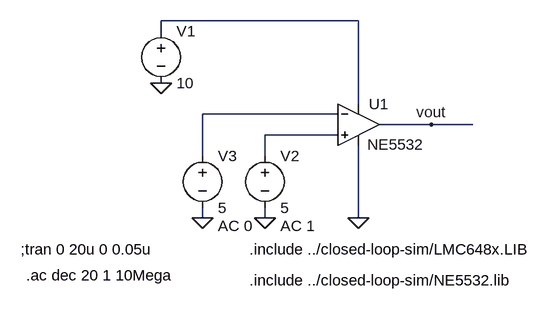
[diagram p0: schematic opamp-test.asc]
opamp-test.asc, the LTspice schematic file:
Version 4
SHEET 1 880 680
WIRE 288 -80 -16 -80
WIRE -16 -64 -16 -80
WIRE 288 48 288 -80
WIRE 256 64 48 64
WIRE 400 80 320 80
WIRE 464 80 400 80
WIRE 256 96 144 96
WIRE 48 128 48 64
WIRE 144 128 144 96
WIRE 48 224 48 208
WIRE 144 224 144 208
WIRE 288 224 288 112
FLAG 288 224 0
FLAG 144 224 0
FLAG 48 224 0
FLAG -16 16 0
FLAG 400 80 vout
SYMBOL voltage -16 -80 R0
WINDOW 123 0 0 Left 0
WINDOW 39 0 0 Left 0
SYMATTR InstName V1
SYMATTR Value 10
SYMBOL voltage 144 112 R0
WINDOW 123 24 124 Left 2
WINDOW 39 0 0 Left 0
SYMATTR Value2 AC 1
SYMATTR InstName V2
SYMATTR Value 5
SYMBOL voltage 48 112 R0
WINDOW 123 24 124 Left 2
WINDOW 39 0 0 Left 0
SYMATTR Value2 AC 0
SYMATTR InstName V3
SYMATTR Value 5
SYMBOL OpAmps\\opamp2 288 16 R0
WINDOW 3 14 95 Left 2
SYMATTR Value NE5532
SYMATTR InstName U1
TEXT 120 272 Left 2 !.include ../closed-loop-sim/LMC648x.LIB
TEXT -232 272 Left 2 !;tran 0 20u 0 0.05u
TEXT 120 320 Left 2 !.include ../closed-loop-sim/NE5532.lib
TEXT -224 312 Left 2 !.ac dec 20 1 10Mega

The netlist it stands for:
* opamp-test.asc
V1 N001 0 10
V2 N003 0 5 AC 1
V3 N002 0 5 AC 0
XU1 N003 N002 N001 0 vout NE5532  ; pins In+ In- V+ V- OUT
.include ../closed-loop-sim/LMC648x.LIB
;tran 0 20u 0 0.05u
.include ../closed-loop-sim/NE5532.lib
.ac dec 20 1 10Mega
.backanno
.end